# EAGLE schematic 3PDT (EAGLE 7.6.0)
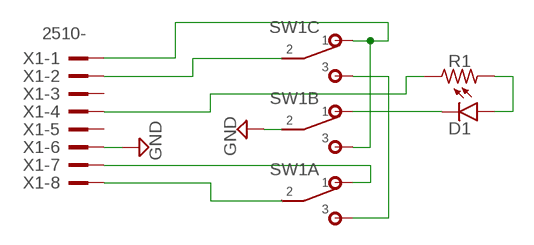
[diagram p0: schematic, sheet 1]

## Parts
D1  LED  [3MM_D]
R1  R_.3B  [R0207/3]
SW1  3PDT  [3PDT]
X1  2510-  [PAK100/2500-10]

## Nets
GND: SW1.B2 X1.6
N$1: SW1.A3 SW1.C3
N$2: SW1.C2 X1.2
N$3: SW1.B3 SW1.C1 X1.1
N$4: SW1.A2 X1.8
N$5: SW1.A1 X1.7
N$7: R1.1 X1.4
N$8: D1.ANODE(A) R1.2
N$9: D1.P$1(C) SW1.B1
Unconnected: X1.3 X1.5

## Library data of the parts
D1 = pedals-diodes:LED
R1 = pedals-resistors:R_
SW1 = pedals-switches:3PDT
X1 = pedals-headers:2510-: 3M (TM) Pak 100 4-Wall Header Source: 3M; MF: 3M; MPN: 2510-6002UB; OC_FARNELL: 9838244; OC_NEWARK: 46F4725